# EAGLE schematic 3_1_b_organized (EAGLE 6.5.0)
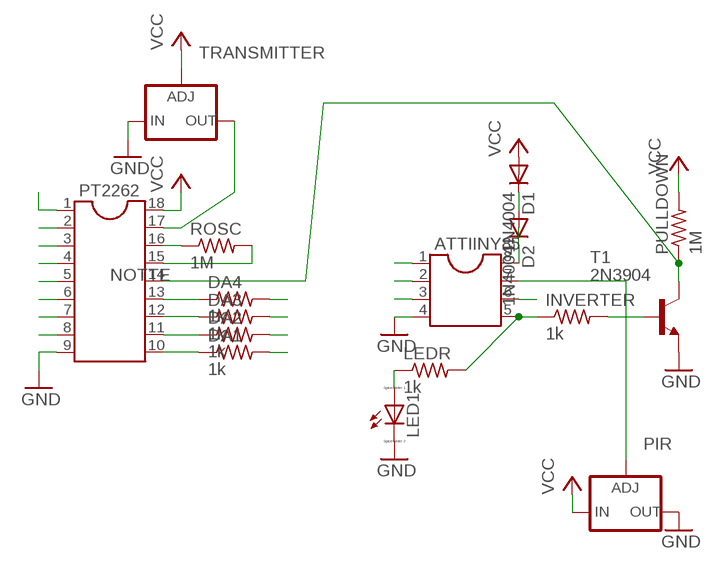
[diagram p0: schematic, sheet 1]

## Parts
ATTIINY85  DIL8  [DIL08]
D1  1N4004  [DO41-10]
D2  1N4004  [DO41-10]
DA1  1k  R-US_0207/5V  [0207/5V]
DA2  1k  R-US_0207/5V  [0207/5V]
DA3  1k  R-US_0207/5V  [0207/5V]
DA4  1k  R-US_0207/5V  [0207/5V]
INVERTER  1k  R-US_0207/5V  [0207/5V]
LED1  LED_ELD260  [LED_LD260]
LEDR  1k  R-US_0204/5  [0204/5]
PIR  LM337TS  [337TS]
PT2262  DIL18  [DIL18]
PULLDOWN  1M  R-US_0207/5V  [0207/5V]
ROSC  1M  R-US_0204/5  [0204/5]
T1  2N3904  [TO92]
TRANSMITTER  LM337TS  [337TS]

## Nets
GND: ATTIINY85.4 LED1.K(C) PIR.3(OUT) PT2262.9 T1.3(E) TRANSMITTER.2(IN)
N$1: D1.C D2.A
N$2: ATTIINY85.8 D2.C
N$3: PT2262.1
N$4: PT2262.2
N$5: PT2262.3
N$6: PT2262.4
N$7: PT2262.5
N$8: PT2262.6
N$9: PT2262.7
N$10: PT2262.8
N$11: DA4.2
N$12: INVERTER.2 T1.2(B)
N$14: DA3.2
N$15: DA2.2
N$16: DA1.2
N$17: ATTIINY85.2
N$18: ATTIINY85.7 PIR.1(ADJ)
N$19: LED1.A LEDR.1
N$21: ATTIINY85.1
N$22: PT2262.17 TRANSMITTER.3(OUT)
N$23: PT2262.16 ROSC.1
N$24: PT2262.15 ROSC.2
N$25: ATTIINY85.6
N$27: ATTIINY85.3
N$34: DA1.1 PT2262.10
N$35: DA3.1 PT2262.12
N$36: DA2.1 PT2262.11
N$37: DA4.1 PT2262.13
N$43: ATTIINY85.5 INVERTER.1 LEDR.2
NOTTE: PT2262.14 PULLDOWN.1 T1.1(C)
VCC: D1.A PIR.2(IN) PT2262.18 PULLDOWN.2 TRANSMITTER.1(ADJ)

## Library data of the parts
ATTIINY85 = ic-package:DIL8: Dual In Line / Socket
D1 D2 = diode:1N4004: DIODE general purpose rectifier, 1 A
DA1-DA4 INVERTER LEDR PULLDOWN = rcl:R-US_: RESISTOR, American symbol
LED1 = eagle-ltspice:LED_E: LED Source: http://www.osram.convergy.de Source: www.luxeon.com Source: www.kingbright.com; SPICEMODEL: NONE; SPICEPREFIX: D; SPICETYPE: diode
PIR TRANSMITTER = v-reg:LM337TS: VOLTAGE REGULATOR
PT2262 = ic-package:DIL18: Dual In Line / Socket
ROSC = resistor:R-US_: RESISTOR, American symbol
T1 = transistor:2N3904: NPN TRANSISTOR